# Altium schematic sheet MCU021_V1.0_ezFET_Host.SchDoc: ez-FET: Host-MCU, USB, Power
size A3; Date: Not shown in title block; ApprovedBy: Not shown in title block; CheckedBy: Not shown in title block; Author: Not shown in title block; CompanyName: Not shown in title block; Engineer: Not shown in title block; Organization: Not shown in title block; Address1: Not shown in title block; Address2: Not shown in title block; Address3: Not shown in title block; Address4: Not shown in title block; DocumentNumber: 2; Revision: Use project parameter SCH_Rev; SheetNumber: 2; SheetTotal: 5; PageSetup: Record=PageOptions|CenterHorizontal=True|CenterVertical=True|PrintScale=1.00|XCorrection=1.00|YCorrection=1.00|PrintKind=0|BorderSize=5000000|LeftOffset=0|BottomOffset=0|Orientation=2|PaperLength=1000|PaperWidth=1000|Scale=100|PaperSource=15|PrintQuality=600|MediaType=1|DitherType=10|PaperKind=Letter|PrintScaleMode=1; CurrentTime: Not shown in title block; CurrentDate: Not shown in title block; Time: Not shown in title block; DocumentFullPathAndName: Not shown in title block; DocumentName: Not shown in title block; ModifiedDate: Not shown in title block; ImagePath: Not shown in title block
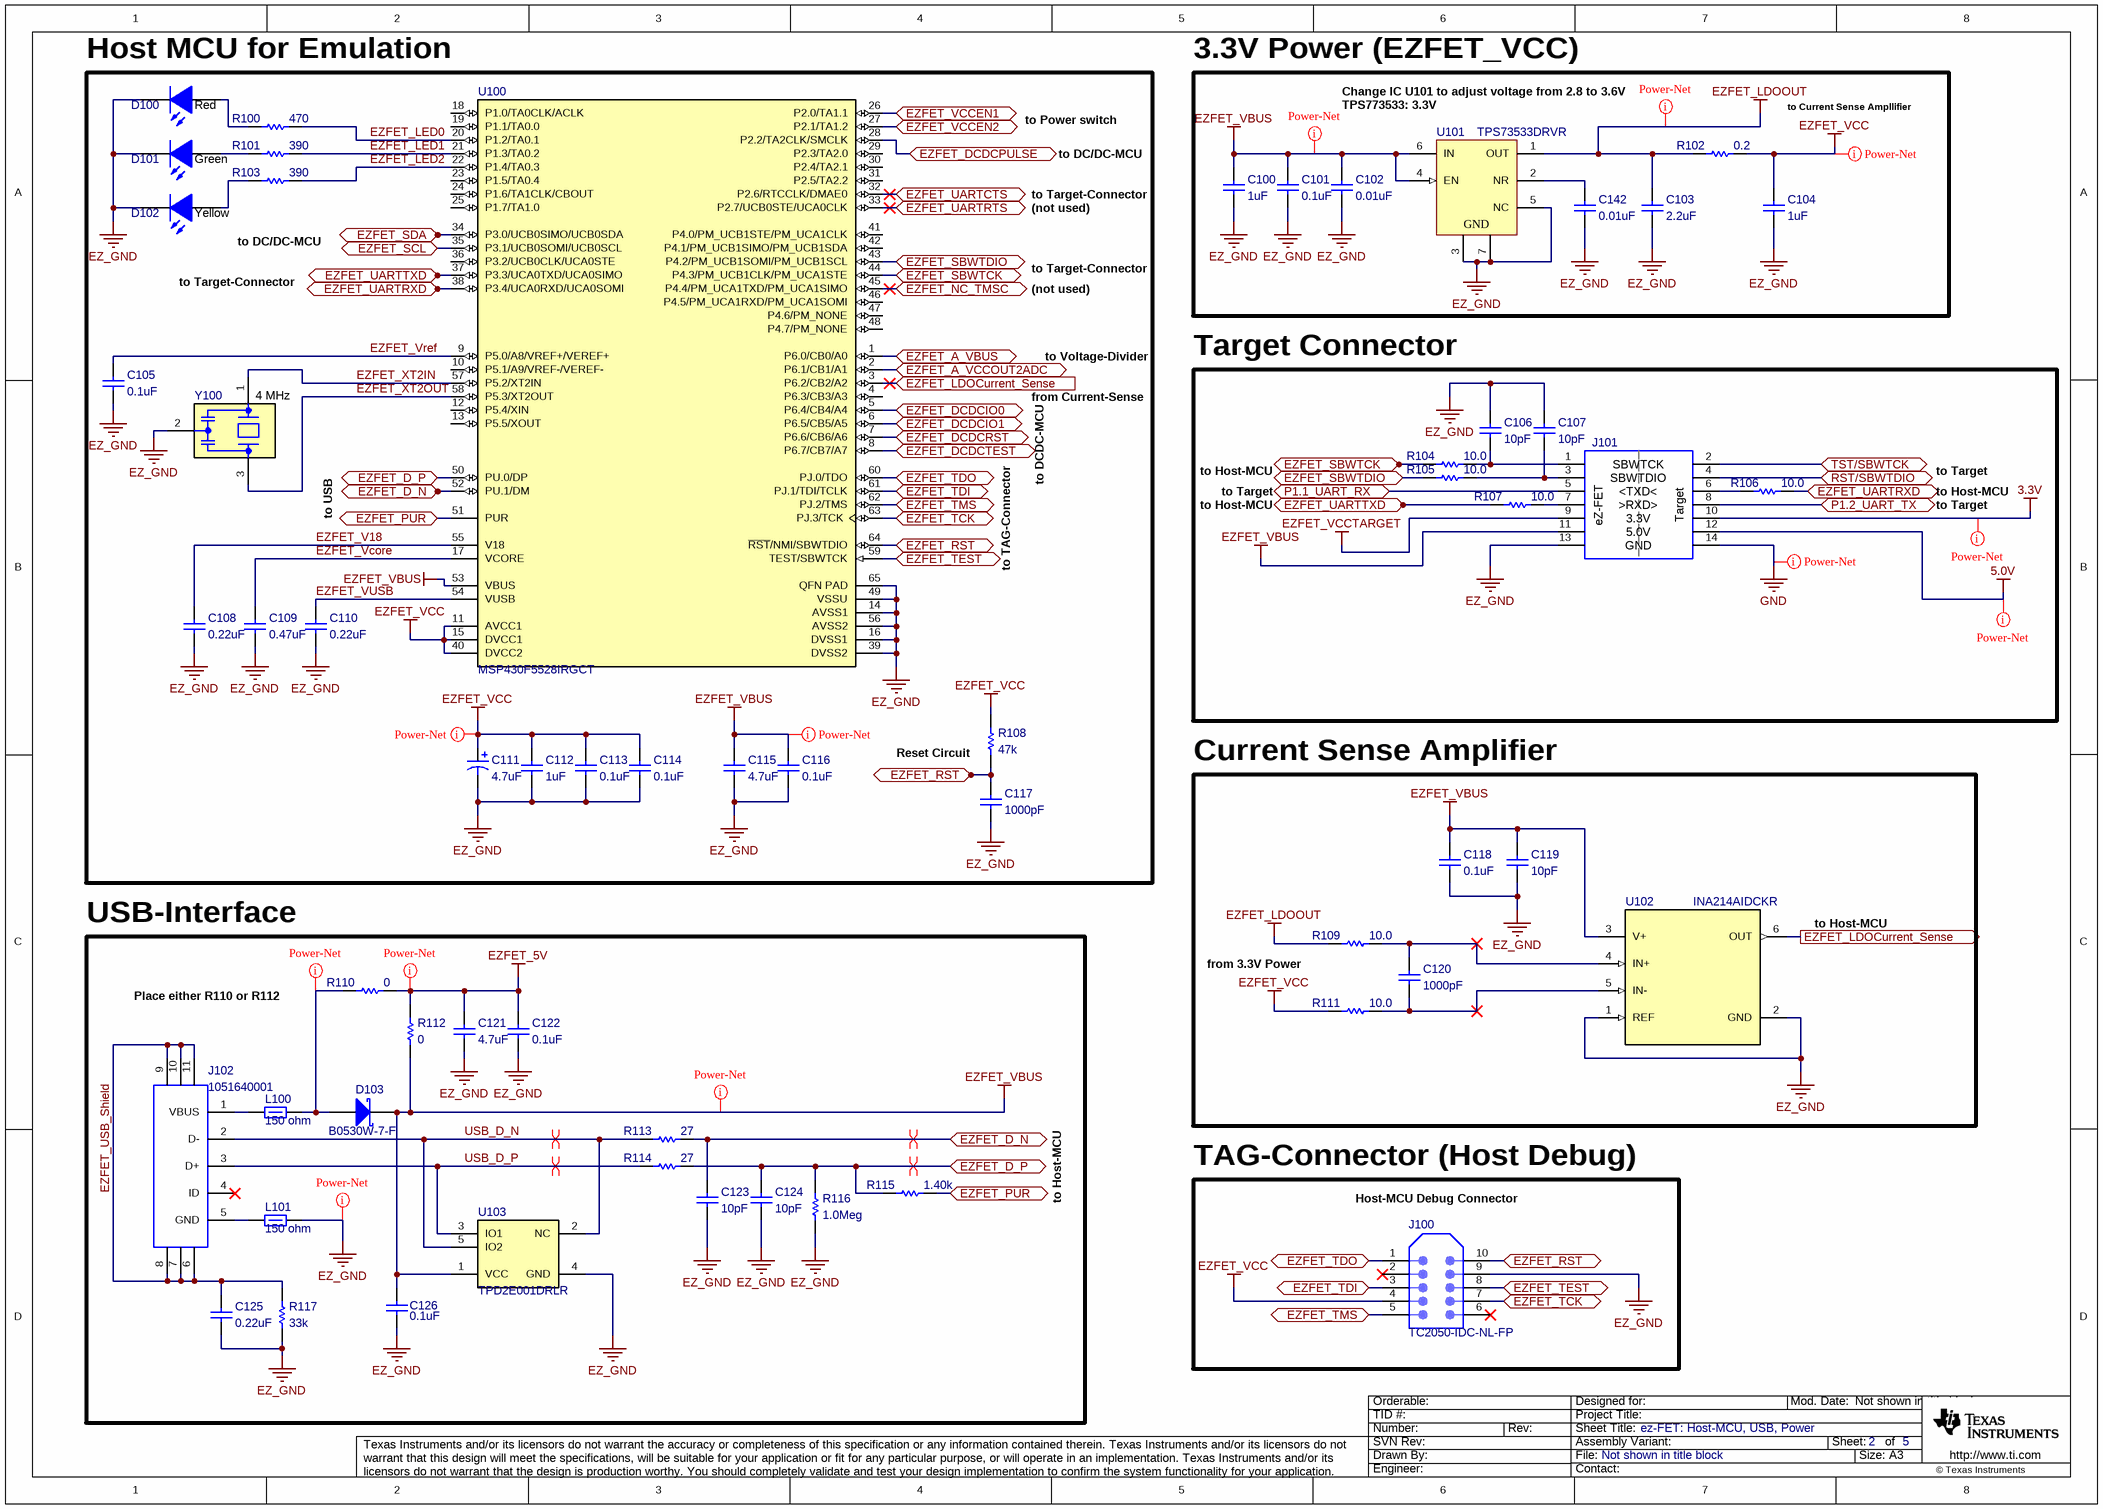
[diagram p0: MCU021_V1.0_ezFET_Host.SchDoc]

## Parts
C100  1uF  [0402]
C101  0.1uF  [0402]
C102  0.01uF  [0402]
C103  2.2uF  [0402]
C104  1uF  [0402]
C105  0.1uF  [0402]
C106  10pF  [0402]
C107  10pF  [0402]
C108  0.22uF  [0402]
C109  0.47uF  [0402]
C110  0.22uF  [0402]
C111  4.7uF  [3216-18]
C112  1uF  [0402]
C113  0.1uF  [0402]
C114  0.1uF  [0402]
C115  4.7uF  [0402]
C116  0.1uF  [0402]
C117  1000pF  [0402]
C118  0.1uF  [0402]
C119  10pF  [0402]
C120  1000pF  [0402]
C121  4.7uF  [0805_HV]
C122  0.1uF  [0402]
C123  10pF  [0402]
C124  10pF  [0402]
C125  0.22uF  [0402]
C126  0.1uF  [0402]
C142  0.01uF  [0402]
D100  value Red  [WL-SMCW_RED]  (hidden comment: 150060RS75000)
D101  value Green  [WL-SMCW_GREEN]  (hidden comment: 150060VS75000)
D102  value Yellow  [WL-SMCW_YELLOW]  (hidden comment: 150060YS75000)
D103  B0530W-7-F  [SOD-123]
J100  TC2050-IDC-NL-FP  [Tag_TC2050-NL]  (no BOM)
J101  PEC07DAAN  [PEC07DAAN_Launchpad_EZ-FET]  (value not drawn)
J102  1051640001  [Molex_1051640001]
L100  150 ohm  [0603]
L101  150 ohm  [0603]
R100  470  [0402]
R101  390  [0402]
R102  0.2  [0603]
R103  390  [0402]
R104  10.0  [0402]
R105  10.0  [0402]
R106  10.0  [0402]
R107  10.0  [0402]
R108  47k  [0402]
R109  10.0  [0402]
R110  0  [1206]
R111  10.0  [0402]
R112  0  [1206]
R113  27  [0402]
R114  27  [0402]
R115  1.40k  [0402]
R116  1.0Meg  [0402]
R117  33k  [0402]
U100  MSP430F5528IRGCT  [RGC0064B]
U101  TPS73533DRVR  [DRV0006A]
U102  INA214AIDCKR  [DCK0006A_N]
U103  TPD2E001DRLR  [DRL0005A]
Y100  Frequency_Fixed: 4 MHz  [Murata_CSTCR]  (hidden comment: CSTCR4M00G15L99-R0)

## Blocks framed on the sheet
Host MCU for Emulation: C105 C108-C117 D100-D102 R100 R101 R103 R108 U100 Y100
3.3V Power (EZFET_VCC): C100-C104 C142 R102 U101
Target Connector: C106 C107 J101 R104-R107
Current Sense Amplifier: C118-C120 R109 R111 U102
USB-Interface: C121-C126 D103 J102 L100 L101 R110 R112-R117 U103
TAG-Connector (Host Debug): J100

## Ports
EZFET_A_VBUS (bidir), EZFET_A_VCCOUT2ADC (bidir), EZFET_D_N (bidir), EZFET_D_P (bidir), EZFET_DCDCIO0 (bidir), EZFET_DCDCIO1 (bidir), EZFET_DCDCPULSE (bidir), EZFET_DCDCRST (bidir), EZFET_DCDCTEST (bidir), EZFET_LDOCurrent_Sense (in), EZFET_LDOCurrent_Sense (out), EZFET_NC_TMSC (bidir), EZFET_PUR (bidir), EZFET_RST (bidir), EZFET_SBWTCK (bidir), EZFET_SBWTDIO (bidir), EZFET_SCL (bidir), EZFET_SDA (bidir), EZFET_TCK (bidir), EZFET_TDI (bidir), EZFET_TDO (bidir), EZFET_TEST (bidir), EZFET_TMS (bidir), EZFET_UARTCTS (bidir), EZFET_UARTRTS (bidir), EZFET_UARTRXD (bidir), EZFET_UARTTXD (bidir), EZFET_VCCEN1 (bidir), EZFET_VCCEN2 (bidir), P1.1_UART_RX (bidir), P1.2_UART_TX (bidir), RST/SBWTDIO (bidir), TST/SBWTCK (bidir)

## Nets
3.3V: J101.10
5.0V: J101.12
EZ_GND: C100.2 C101.2 C102.2 C103.2 C104.2 C105.2 C106.1 C107.1 C108.2 C109.1 C110.2 C111.2(-) C112.2 C113.2 C114.2 C115.2 C116.2 C117.2 C118.2 C119.2 C121.2 C122.2 C123.2 C124.2 C125.2 C126.2 C142.2 D100.1(K) D101.1(K) D102.1(K) J100.9 J101.13 L101.2 R116.1 R117.1 U100.14(AVSS1) U100.16(DVSS1) U100.39(DVSS2) U100.49(VSSU) U100.56(AVSS2) U100.65(QFN_PAD) U101.3(GND) U101.5(NC) U101.7(GND) U102.1(REF) U102.2(GND) U103.4(GND) Y100.2(GND)
EZFET_5V: C121.1 C122.1 R110.1 R112.2
EZFET_LDOOUT: C103.1 R102.1 R109.1 U101.1(OUT)
EZFET_VBUS: C100.1 C101.1 C102.1 C115.1 C116.1 C118.1 C119.1 C126.1 D103.1(K) J101.11 R112.1 U100.53(VBUS) U101.4(EN) U101.6(IN) U102.3(V+) U103.1(VCC)
EZFET_VCC: C104.1 C111.1(+) C112.1 C113.1 C114.1 J100.4 R102.2 R108.2 R111.1 U100.11(AVCC1) U100.15(DVCC1) U100.40(DVCC2)
EZFET_VCCTARGET: J101.9
GND: J101.14
EZFET_A_VBUS: U100.1(P6.0/CB0/A0) ; port EZFET_A_VBUS
EZFET_A_VCCOUT2ADC: U100.2(P6.1/CB1/A1) ; port EZFET_A_VCCOUT2ADC
EZFET_D_N: C123.1 R113.2 U100.52(PU.1/DM) ; port EZFET_D_N
EZFET_D_P: C124.1 R114.2 R115.1 R116.2 U100.50(PU.0/DP) ; port EZFET_D_P
EZFET_DCDCIO0: U100.5(P6.4/CB4/A4) ; port EZFET_DCDCIO0
EZFET_DCDCIO1: U100.6(P6.5/CB5/A5) ; port EZFET_DCDCIO1
EZFET_DCDCPULSE: U100.28(P2.2/TA2CLK/SMCLK) ; port EZFET_DCDCPULSE
EZFET_DCDCRST: U100.7(P6.6/CB6/A6) ; port EZFET_DCDCRST
EZFET_DCDCTEST: U100.8(P6.7/CB7/A7) ; port EZFET_DCDCTEST
EZFET_LDOCurrent_Sense: U100.3(P6.2/CB2/A2) U102.6(OUT) ; port EZFET_LDOCurrent_Sense
EZFET_LED0: R100.2 U100.20(P1.2/TA0.1)
EZFET_LED1: R101.2 U100.21(P1.3/TA0.2)
EZFET_LED2: R103.2 U100.22(P1.4/TA0.3)
EZFET_NC_TMSC: U100.45(P4.4/PM_UCA1TXD/PM_UCA1SIMO) ; port EZFET_NC_TMSC
EZFET_PUR: R115.2 U100.51(PUR) ; port EZFET_PUR
EZFET_RST: C117.1 J100.10 R108.1 U100.64(~{RST}/NMI/SBWTDIO) ; port EZFET_RST
EZFET_SBWTCK: R104.1 U100.44(P4.3/PM_UCB1CLK/PM_UCA1STE) ; port EZFET_SBWTCK
EZFET_SBWTDIO: R105.1 U100.43(P4.2/PM_UCB1SOMI/PM_UCB1SCL) ; port EZFET_SBWTDIO
EZFET_SCL: U100.35(P3.1/UCB0SOMI/UCB0SCL) ; port EZFET_SCL
EZFET_SDA: U100.34(P3.0/UCB0SIMO/UCB0SDA) ; port EZFET_SDA
EZFET_TCK: J100.7 U100.63(PJ.3/TCK) ; port EZFET_TCK
EZFET_TDI: J100.3 U100.61(PJ.1/TDI/TCLK) ; port EZFET_TDI
EZFET_TDO: J100.1 U100.60(PJ.0/TDO) ; port EZFET_TDO
EZFET_TEST: J100.8 U100.59(TEST/SBWTCK) ; port EZFET_TEST
EZFET_TMS: J100.5 U100.62(PJ.2/TMS) ; port EZFET_TMS
EZFET_UARTCTS: U100.32(P2.6/RTCCLK/DMAE0) ; port EZFET_UARTCTS
EZFET_UARTRTS: U100.33(P2.7/UCB0STE/UCA0CLK) ; port EZFET_UARTRTS
EZFET_UARTRXD: R106.2 U100.38(P3.4/UCA0RXD/UCA0SOMI) ; port EZFET_UARTRXD
EZFET_UARTTXD: R107.1 U100.37(P3.3/UCA0TXD/UCA0SIMO) ; port EZFET_UARTTXD
EZFET_USB_Shield: C125.1 J102.6 J102.7 J102.8 J102.9 J102.10 J102.11 R117.2
EZFET_V18: C108.1 U100.55(V18)
EZFET_VCCEN1: U100.26(P2.0/TA1.1) ; port EZFET_VCCEN1
EZFET_VCCEN2: U100.27(P2.1/TA1.2) ; port EZFET_VCCEN2
EZFET_Vcore: C109.2 U100.17(VCORE)
EZFET_Vref: C105.1 U100.9(P5.0/A8/VREF+/VEREF+)
EZFET_VUSB: C110.1 U100.54(VUSB)
EZFET_XT2IN: U100.57(P5.2/XT2IN) Y100.1(In)
EZFET_XT2OUT: U100.58(P5.3/XT2OUT) Y100.3(Out)
P1.1_UART_RX: J101.5 ; port P1.1_UART_RX
P1.2_UART_TX: J101.8 ; port P1.2_UART_TX
RST/SBWTDIO: J101.4 ; port RST/SBWTDIO
TST/SBWTCK: J101.2 ; port TST/SBWTCK
USB_D_N: J102.2(D-) R113.1 U103.2(NC) U103.5(IO2)
USB_D_P: J102.3(D+) R114.1 U103.3(IO1)
NetC106_2: C106.2 J101.1 R104.2
NetC107_2: C107.2 J101.3 R105.2
NetC120_1: C120.1 R109.2 U102.4(IN+)
NetC120_2: C120.2 R111.2 U102.5(IN-)
NetC142_1: C142.1 U101.2(NR)
NetD100_2: D100.2(A) R100.1
NetD101_2: D101.2(A) R101.1
NetD102_2: D102.2(A) R103.1
NetD103_2: D103.2(A) L100.2 R110.2
NetJ101_6: J101.6 R106.1
NetJ101_7: J101.7 R107.2
NetJ102_1: J102.1(VBUS) L100.1
NetJ102_5: J102.5(GND) L101.1

Not connected (* = marked no-connect by the designer): J100 2* 6*; J102 4(ID)*; U100 4(P6.3/CB3/A3) 10(P5.1/A9/VREF-/VEREF-) 12(P5.4/XIN) 13(P5.5/XOUT) 18(P1.0/TA0CLK/ACLK) 19(P1.1/TA0.0) 23(P1.5/TA0.4) 24(P1.6/TA1CLK/CBOUT) 25(P1.7/TA1.0) 29(P2.3/TA2.0) 30(P2.4/TA2.1) 31(P2.5/TA2.2) 36(P3.2/UCB0CLK/UCA0STE) 41(P4.0/PM_UCB1STE/PM_UCA1CLK) 42(P4.1/PM_UCB1SIMO/PM_UCB1SDA) 46(P4.5/PM_UCA1RXD/PM_UCA1SOMI) 47(P4.6/PM_NONE) 48(P4.7/PM_NONE)

## Layout directives
differential pair: EZFET_D_N, EZFET_D_P, USB_D_N, USB_D_P
net class Power-Net: 3.3V, 5.0V, EZ_GND, EZFET_5V, EZFET_LDOOUT, EZFET_VBUS, EZFET_VCC, GND, NetD103_2

## Notes on the sheet
- Change IC U101 to adjust voltage from 2.8 to 3.6V
- (near U101) TPS773533: 3.3V
- to Current Sense Ampllifier
- to Power switch
- to DC/DC-MCU
- to Target-Connector
- (not used)
- to Voltage-Divider
- to DCDC-MCU
- from Current-Sense
- to USB
- to TAG-Connector
- to Host-MCU
- to Target
- (near R108) Reset Circuit
- from 3.3V Power
- Place either R110 or R112
- Host-MCU Debug Connector
- Drawn By:
- SVN Rev:
- Number:
- TID #:
- Orderable:
- Rev:
- Sheet Title:
- File:
- Project Title:
- Designed for:
- Assembly Variant:
- Mod. Date:
- Sheet:
- Size:
- of
- A3
- http://www.ti.com
- Texas Instruments and/or its licensors do not warrant the accuracy or completeness of this specification or any information contained therein. Texas Instruments and/or its licensors do not warrant that this design will meet the specifications, will be suitable for your application or fit for any particular purpose, or will operate in an implementation. Texas Instruments and/or its licensors do not warrant that the design is production worthy. You should completely validate and test your design implementation to confirm the system functionality for your application.
- Engineer:
- Contact:
- © Texas Instruments
- (in symbol PEC07DAAN) SBWTCK; SBWTDIO; <TXD<; eZ-FET; >RXD>; Target; 3.3V; 5.0V; GND

## Library data of the parts
C100 C104 C112 = GRM155R61A105KE15D: CAP, CERM, 1 µF, 10 V,+/- 10%, X5R, 0402; Manufacturer: MuRata; Polarized: N; CompType: Capacitor; ValueDisplayed: 1µF; U/M: EA; Cap_F: 0.000001; Tolerance_%: 10; Value1: Unknown; Value2: 10V; TaMin_C: -55; TaMax_C: 85; SizeArea_mm2: 0.5; SizeAreaWB_mm2: 3; SizeX_mm: 1; SizeZ_mm: 0.6; AEC Category: Q200; Green_Lifecycle: Active; Green_REACh: Passed; SymbolVersion: 2008-07-09; Value: 1uF; PartNumber: GRM155R61A105KE15D; PackageReference: 0402; RoHS: Y; VDC_V: 10; MountType: SMT; Technology: Ceramic; TempCo: X5R; Cap_Case: 0402; SizeY_mm: 0.5; Published: 2008-06-19; Publisher: Texas Instruments; LatestRevisionDate: 2017-05-28; ComponentLink1Description: Datasheet link; ComponentLink1URL: http://search.murata.co.jp/Ceramy/PnsearchViewAction.do?HnOFG=ON&HnNFG=ON&SEL_CNT=50&sLang=en&sKey=GRM155R61A105KE15D&x=9&y=9&search=startwith; Supplier 1: Digi-Key; Supplier Part Number 1: 490-3890-1-ND; Supplier 2: Mouser; Supplier Part Number 2: 81-GRM155R61A105KE15; Supplier 3: Farnell; Supplier Part Number 3: 1735523; AEC Qualified: ?; Green_EU RoHS: Passed; Green_EU RoHS-2: Incomplete
C101 C105 C113 C114 C116 C118 C122 C126 = GRM155R61A104KA01D: CAP, CERM, 0.1 µF, 10 V,+/- 10%, X5R, 0402; Manufacturer: MuRata; Polarized: N; CompType: Capacitor; ValueDisplayed: 0.1µF; U/M: EA; Cap_F: 0.0000001; Tolerance_%: 10; Value1: Unknown; Value2: 10V; TaMin_C: -55; TaMax_C: 85; SizeArea_mm2: 0.5; SizeAreaWB_mm2: 3; SizeX_mm: 1; SizeZ_mm: 0.6; AEC Category: Q200; Green_Lifecycle: Active; Green_REACh: Passed; SymbolVersion: 2008-07-09; Value: 0.1uF; PartNumber: GRM155R61A104KA01D; PackageReference: 0402; RoHS: Y; VDC_V: 10; MountType: SMT; Technology: Ceramic; TempCo: X5R; Cap_Case: 0402; SizeY_mm: 0.5; Published: 2008-06-19; Publisher: Texas Instruments; LatestRevisionDate: 2017-05-28; ComponentLink1Description: Datasheet link; ComponentLink1URL: http://search.murata.co.jp/Ceramy/PnsearchViewAction.do?HnOFG=ON&HnNFG=ON&SEL_CNT=50&sLang=en&sKey=GRM155R61A104KA01D&x=9&y=9&search=startwith; Supplier 1: Digi-Key; Supplier Part Number 1: 490-1318-1-ND; Supplier 2: Mouser; Supplier Part Number 2: 81-GRM155R61A104KA01; Supplier 3: Farnell; Supplier Part Number 3: 1828862; AEC Qualified: ?; Green_EU RoHS: Passed; Green_EU RoHS-2: Incomplete
C102 C142 = GRM155R71C103KA01D: CAP, CERM, 0.01 µF, 16 V,+/- 10%, X7R, 0402; Manufacturer: MuRata; Polarized: N; CompType: Capacitor; ValueDisplayed: 0.01µF; U/M: EA; Cap_F: 0.00000001; Tolerance_%: 10; Value1: Unknown; VDC_V: 16; Value2: 16V; TaMin_C: -55; TaMax_C: 125; SizeArea_mm2: 0.5; SizeAreaWB_mm2: 3; SizeX_mm: 1; SizeZ_mm: 0.6; AEC Category: Q200; Green_Lifecycle: Active; Green_REACh: Passed; SymbolVersion: 2008-07-09; Value: 0.01uF; PartNumber: GRM155R71C103KA01D; PackageReference: 0402; RoHS: Y; MountType: SMT; Technology: Ceramic; TempCo: X7R; Cap_Case: 0402; SizeY_mm: 0.5; Published: 2008-06-19; Publisher: Texas Instruments; LatestRevisionDate: 2017-05-28; ComponentLink1Description: Datasheet link; ComponentLink1URL: http://search.murata.co.jp/Ceramy/PnsearchViewAction.do?HnOFG=ON&HnNFG=ON&SEL_CNT=50&sLang=en&sKey=GRM155R71C103KA01D&x=9&y=9&search=startwith; Supplier 1: Digi-Key; Supplier Part Number 1: 490-1313-1-ND; Supplier 2: Newark; Supplier Part Number 2: 14T3279; Supplier 3: Mouser; Supplier Part Number 3: 81-GRM36X103K16; AEC Qualified: ?; Green_EU RoHS: Passed; Green_EU RoHS-2: Incomplete
C103 = CMP-0006594-2: CAP, CERM, 2.2 uF, 16 V, +/- 10%, X5R, 0402; Manufacturer: MuRata; PartNumber: GRM155R61C225KE11D; TaMin_C: -55°C; Polarized: N; SizeAreaWB_mm2: 3; Value1: Unknown; U/M: EA; TaMax_C: 85°C; SizeZ_mm: 0.6; SizeX_mm: 1; SizeY_mm: 0.5; Value2: 16V; CompType: Capacitor; Cap_F: 2.2µF; AEC Category: Q200; Supplier Part Number 2: 81-GRM155R61C225KE1D; Publisher: Texas Instruments; Supplier 2: Mouser; TempCo: X5R; Published: 2008-06-19; RoHS: Y; MountType: SMT; Value: 2.2uF; Supplier 1: Digi-Key; PackageReference: 0402; Tolerance_%: 10%; Cap_Case: 0402; SizeArea_mm2: 0.5; LatestRevisionDate: 2017-03-09; AEC Qualified: N; VDC_V: 16V; ComponentLink1Description: Datasheet link; AEC Grade: N/A; Supplier Part Number 1: 490-10695-1-ND; Technology: Ceramic; ValueDisplayed: 2.2uF; ComponentLink1URL: http://psearch.en.murata.com/capacitor/product/GRM155R61C225KE11%23.pdf
C106 C107 C119 C123 C124 = GRM1555C1H100FA01D: CAP, CERM, 10 pF, 50 V,+/- 1%, C0G/NP0, 0402; Manufacturer: MuRata; Polarized: N; CompType: Capacitor; U/M: EA; Cap_F: 0.00000000001; Tolerance_%: 1; Value1: Unknown; VDC_V: 50; Value2: 50V; TaMin_C: -55; TaMax_C: 125; SizeArea_mm2: 0.5; SizeAreaWB_mm2: 3; SizeZ_mm: 0.6; AEC Category: Q200; SymbolVersion: 2008-07-09; Value: 10pF; PartNumber: GRM1555C1H100FA01D; ValueDisplayed: 10pF; PackageReference: 0402; RoHS: Y; MountType: SMT; Technology: Ceramic; TempCo: C0G/NP0; Cap_Case: 0402; SizeX_mm: 1; SizeY_mm: 0.5; Published: 2008-06-19; Publisher: Texas Instruments; LatestRevisionDate: 2017-05-28; ComponentLink1Description: Datasheet link; ComponentLink1URL: http://psearch.en.murata.com/capacitor/product/GRM1555C1H100FA01%23.pdf; Supplier 1: Digi-Key; Supplier Part Number 1: 490-6186-1-ND; Supplier 2: Mouser; Supplier Part Number 2: 81-GRM1555C1H100FA1D; AEC Qualified: N; AEC Grade: N/A
C108 C110 C125 = GRM155R61A224KE19D: CAP, CERM, 0.22 µF, 10 V,+/- 10%, X5R, 0402; Manufacturer: MuRata; Polarized: N; CompType: Capacitor; ValueDisplayed: 0.22µF; U/M: EA; Cap_F: 0.00000022; Tolerance_%: 10; Value1: Unknown; Value2: 10V; TaMin_C: -55; TaMax_C: 85; SizeArea_mm2: 0.5; SizeAreaWB_mm2: 3; SizeX_mm: 1; SizeZ_mm: 0.6; AEC Category: Q200; Green_Lifecycle: Active; Green_REACh: Passed; SymbolVersion: 2008-07-09; Value: 0.22uF; PartNumber: GRM155R61A224KE19D; PackageReference: 0402; RoHS: Y; VDC_V: 10; MountType: SMT; Technology: Ceramic; TempCo: X5R; Cap_Case: 0402; SizeY_mm: 0.5; Published: 2008-06-19; Publisher: Texas Instruments; LatestRevisionDate: 2017-05-28; ComponentLink1Description: Datasheet link; ComponentLink1URL: http://search.murata.co.jp/Ceramy/PnsearchViewAction.do?HnOFG=ON&HnNFG=ON&SEL_CNT=50&sLang=en&sKey=GRM155R61A224KE19D&x=9&y=9&search=startwith; Supplier 1: Digi-Key; Supplier Part Number 1: 490-3910-1-ND; Supplier 2: Newark; Supplier Part Number 2: 38K1646; Supplier 3: Mouser; Supplier Part Number 3: 81-GRM155R61A224KE19; AEC Qualified: ?; Green_EU RoHS: Passed; Green_EU RoHS-2: Incomplete
C109 = GRM155R61C474KE01: CAP, CERM, 0.47 µF, 16 V,+/- 10%, X5R, 0402; Manufacturer: MuRata; Polarized: N; CompType: Capacitor; ValueDisplayed: 0.47µF; U/M: EA; Cap_F: 0.00000047; Tolerance_%: 10; Value1: Unknown; VDC_V: 16; Value2: 16V; TaMin_C: -55; TaMax_C: 85; SizeArea_mm2: 0.5; SizeAreaWB_mm2: 3; SizeX_mm: 1; SizeZ_mm: 0.6; AEC Category: Q200; Green_Lifecycle: Active; Green_REACh: Passed; SymbolVersion: 2008-07-09; Value: 0.47uF; PartNumber: GRM155R61C474KE01; PackageReference: 0402; RoHS: Y; MountType: SMT; Technology: Ceramic; TempCo: X5R; Cap_Case: 0402; SizeY_mm: 0.5; Published: 2008-06-19; Publisher: Texas Instruments; LatestRevisionDate: 2017-05-28; ComponentLink1Description: Datasheet link; ComponentLink1URL: http://psearch.murata.com/capacitor/product/GRM155R61C474KE01%23.pdf; AEC Qualified: ?; Green_EU RoHS: Passed; Green_EU RoHS-2: Incomplete
C111 = 293D475X9010A2TE3: CAP, TA, 4.7 µF, 10 V, +/- 10%, 5 ohm, SMD; Manufacturer: Vishay-Sprague; Polarized: Y; CompType: Capacitor; ValueDisplayed: 4.7µF; U/M: EA; Cap_F: 0.0000047; Tolerance_%: 10; Value1: 5 ohm; Value2: 10V; ESR_ohm: 5; IRMS_A: 0.12; TaMin_C: -55; TaMax_C: 125; Cap_Case: A; SizeAreaWB_mm2: 10.92; SizeArea_mm2: 5.12; SizeX_mm: 3.2; SizeY_mm: 1.6; SizeZ_mm: 1.8; AEC Category: Q200; SymbolVersion: 2008-07-09; Value: 4.7uF; PartNumber: 293D475X9010A2TE3; PackageReference: 3216-18; RoHS: Y; VDC_V: 10; MountType: SMT; Technology: TA; Series: 293D; Publisher: Texas Instruments; LatestRevisionDate: 2017-03-13; LatestRevisionNote: Updated supplier links; ComponentLink1Description: Datasheet link; ComponentLink1URL: http://www.vishay.com/docs/40002/293d.pdf; Supplier 1: Digi-Key; Supplier Part Number 1: 718-1146-1-ND; Supplier 2: Mouser; Supplier Part Number 2: 74-293D475X9010A2TE3; Supplier 3: Farnell; Supplier Part Number 3: 197397; AEC Qualified: ?
C115 = GRM155R60J475ME87D: CAP, CERM, 4.7 µF, 6.3 V,+/- 20%, X5R, 0402; Manufacturer: MuRata; Polarized: N; CompType: Capacitor; ValueDisplayed: 4.7µF; U/M: EA; Cap_F: 0.0000047; Tolerance_%: 20; ESR_ohm: 0.009; Value1: 0.009 ohm; VDC_V: 6.3; Value2: 6.3V; IRMS_A: 1.22; TaMin_C: -55; TaMax_C: 85; SizeArea_mm2: 0.5; SizeAreaWB_mm2: 3; SizeX_mm: 1; SizeZ_mm: 0.6; AEC Category: Q200; Green_Lifecycle: Active; Green_REACh: Passed; SymbolVersion: 2008-07-09; Value: 4.7uF; PartNumber: GRM155R60J475ME87D; PackageReference: 0402; RoHS: Y; MountType: SMT; Technology: Ceramic; TempCo: X5R; Cap_Case: 0402; SizeY_mm: 0.5; Published: 2008-06-19; Publisher: Texas Instruments; LatestRevisionDate: 2017-05-28; ComponentLink1Description: Datasheet link; ComponentLink1URL: http://www.murata.com/products/catalog/pdf/c02e.pdf; Supplier 1: Digi-Key; Supplier Part Number 1: 490-5408-1-ND; AEC Qualified: ?; Green_EU RoHS: Passed; Green_EU RoHS-2: Incomplete
C117 C120 = GRM155R71H102KA01D: CAP, CERM, 1000 pF, 50 V,+/- 10%, X7R, 0402; Manufacturer: MuRata; Polarized: N; CompType: Capacitor; U/M: EA; Cap_F: 0.000000001; Tolerance_%: 10; Value1: Unknown; VDC_V: 50; Value2: 50V; TaMin_C: -55; TaMax_C: 125; SizeArea_mm2: 0.5; SizeAreaWB_mm2: 3; SizeX_mm: 1; SizeZ_mm: 0.6; AEC Category: Q200; Green_Lifecycle: Active; Green_REACh: Passed; SymbolVersion: 2008-07-09; Value: 1000pF; PartNumber: GRM155R71H102KA01D; ValueDisplayed: 1000pF; PackageReference: 0402; RoHS: Y; MountType: SMT; Technology: Ceramic; TempCo: X7R; Cap_Case: 0402; SizeY_mm: 0.5; Published: 2008-06-19; Publisher: Texas Instruments; ComponentLink1Description: Datasheet link; ComponentLink1URL: http://search.murata.co.jp/Ceramy/PnsearchViewAction.do?HnOFG=ON&HnNFG=ON&SEL_CNT=50&sLang=en&sKey=GRM155R71H102KA01D&x=9&y=9&search=startwith; Supplier 1: Digi-Key; Supplier Part Number 1: 490-1303-1-ND; Supplier 2: Newark; Supplier Part Number 2: 14T3283; Supplier 3: Mouser; Supplier Part Number 3: 81-GRM36X102K50; AEC Qualified: ?; Green_EU RoHS: Passed; Green_EU RoHS-2: Incomplete
  C117: LatestRevisionDate: 2017-05-28
  C120: LatestRevisionDate: 2017-06-12
C121 = C0805C475K8PACTU: CAP, CERM, 4.7 µF, 10 V,+/- 10%, X5R, 0805; Manufacturer: Kemet; Polarized: N; CompType: Capacitor; ValueDisplayed: 4.7µF; U/M: EA; Cap_F: 0.0000047; Tolerance_%: 10; ESR_ohm: 0.004; Value1: 0.004 ohm; Value2: 10V; IRMS_A: 9.89; TaMin_C: -55; TaMax_C: 85; Cap_Case: 0805; SizeArea_mm2: 2.5; SizeAreaWB_mm2: 6.75; SizeX_mm: 2; SizeY_mm: 1.25; SizeZ_mm: 1.45; AEC Category: Q200; Green_Lifecycle: Active; Green_REACh: Passed; SymbolVersion: 2008-07-09; Value: 4.7uF; PartNumber: C0805C475K8PACTU; PackageReference: 0805; RoHS: Y; VDC_V: 10; MountType: SMT; Technology: Ceramic; TempCo: X5R; Published: 2008-06-19; Publisher: Texas Instruments; LatestRevisionDate: 2017-05-28; ComponentLink1Description: Datasheet link; ComponentLink1URL: http://www.kemet.com/kemet/web/homepage/kechome.nsf/file/Partial%20Copy%20-%20Ceramic%20Surface%20Mount%20Capacitors/$file/F3102_CE.pdf; Supplier 1: Digi-Key; Supplier Part Number 1: 399-3133-1-ND; Supplier 2: Newark; Supplier Part Number 2: 70K9144; Supplier 3: Mouser; Supplier Part Number 3: 80-C0805C475K8P; AEC Qualified: ?; Green_EU RoHS: Passed; Green_EU RoHS-2: Passed
D100 = 150060RS75000: LED, Red, SMD; Manufacturer: Wurth Elektronik; Type: AlInGaP; Vf_V: 2; Value2: 2V; Io_A: 0.03; Vr_V: 5; Tjmax_C: 85; Power_TotalModule: 0.072; Value1: 0.072W; Angle: 140; U/M: EA; Green_Lifecycle: Active; Green_REACh: Passed; CompType: LED; PartNumber: 150060RS75000; SymbolVersion: 2008-11-06; MountType: SMT; RoHS: Y; PackageReference: LED_0603; Color: Red; Published: 2008-07-11; Publisher: Texas Instruments; ComponentLink1URL: http://katalog.we-online.de/led/datasheet/150060RS75000.pdf; ComponentLink1Description: Datasheet link; LatestRevisionDate: 2017-05-19; Supplier 1: Digi-Key; Supplier Part Number 1: 732-4978-1-ND; Supplier 2: Newark; Supplier Part Number 2: 95W3795; Supplier 3: Mouser; Supplier Part Number 3: 710-150060RS75000; Green_EU RoHS: Passed; Green_EU RoHS-2: Incomplete
D101 = 150060VS75000: LED, Green, SMD; Manufacturer: Wurth Elektronik; Type: AlInGaP; Vf_V: 2; Value2: 2V; Io_A: 0.02; Value1: W; U/M: EA; Green_Lifecycle: Active; Green_REACh: Passed; CompType: LED; PartNumber: 150060VS75000; SymbolVersion: 2008-11-06; MountType: SMT; RoHS: Y; PackageReference: LED_0603; Color: green; Published: 2008-07-11; Publisher: Texas Instruments; ComponentLink1URL: http://katalog.we-online.de/led/datasheet/150060VS75000.pdf; ComponentLink1Description: Datasheet link; LatestRevisionDate: 2017-05-19; Supplier 1: Digi-Key; Supplier Part Number 1: 732-4980-1-ND; Supplier 2: Newark; Supplier Part Number 2: 95W3797; Supplier 3: Farnell; Supplier Part Number 3: 2322073; Green_EU RoHS: Passed; Green_EU RoHS-2: Incomplete
D102 = 150060YS75000: LED, Yellow, SMD; Manufacturer: Wurth Elektronik; Type: AlInGaP; Vf_V: 2; Value2: 2V; Io_A: 0.02; Value1: W; U/M: EA; Green_Lifecycle: Active; Green_REACh: Passed; CompType: LED; PartNumber: 150060YS75000; SymbolVersion: 2008-11-06; MountType: SMT; RoHS: Y; PackageReference: LED_0603; Color: yellow; Published: 2008-07-11; Publisher: Texas Instruments; ComponentLink1URL: http://katalog.we-online.de/led/datasheet/150060YS75000.pdf; ComponentLink1Description: Datasheet link; LatestRevisionDate: 2017-05-19; Supplier 1: Digi-Key; Supplier Part Number 1: 732-4981-1-ND; Supplier 2: Newark; Supplier Part Number 2: 95W3798; Supplier 3: Farnell; Supplier Part Number 3: 2322074; Green_EU RoHS: Passed; Green_EU RoHS-2: Incomplete
D103 = B0530W-7-F: Diode, Schottky, 30 V, 0.5 A, SOD-123; Manufacturer: Diodes Inc.; U/M: EA; Vf_V: 0.43; Value: 30V; Value1: 0.5A; Value2: 0.43V; Io_A: 0.5; Vr_V: 30; TJmax_C: 125; SizeAreaWB_mm2: 13.095; SizeArea_mm2: 6.545; SizeX_mm: 3.85; SizeY_mm: 1.7; SizeZ_mm: 1.35; AEC Category: Q101; Green_Lifecycle: Active; Green_REACh: Passed; CompType: Diode; SymbolVersion: 2008-12-08; PartNumber: B0530W-7-F; PackageReference: SOD-123; MountType: SMT; Type: Schottky; RoHS: Y; Published: 2008-06-26; Publisher: Texas Instruments; LatestRevisionDate: 2017-05-30; ComponentLink1Description: Datasheet link; ComponentLink1URL: http://www.diodes.com/datasheets/ds30139.pdf; Supplier 1: Digi-Key; Supplier Part Number 1: B0530W-FDICT-ND; Supplier 2: Newark; Supplier Part Number 2: 12T1451; Supplier 3: Mouser; Supplier Part Number 3: 621-B0530W-F; AEC Qualified: ?; Green_EU RoHS: Passed; Green_EU RoHS-2: Passed
J100 = TC2050-IDC-NL-FP: Footprint for Tag-Connect TC2050 No-Legs cables; SymbolCreator: Altium; CompType: Receptacle; Note: Footprint only, to mate with Tag-Connect TC2050 No-Legs cables; SymbolVersion: 2015-06-15; PartNumber: TC2050-IDC-NL-FP; Manufacturer: Tag-Connect; PackageReference: Footprint for TC2050 No Legs series of cables; MountType: N/A; ComponentLink1Description: Datasheet URL; ComponentLink1URL: http://www.tag-connect.com/Materials/TC2050-IDC-430-NL%20Datasheet.pdf; Publisher: Texas Instruments; LatestRevisionDate: 2017-06-13
J101 = PEC07DAAN: Header, 100mil, 7x2, Tin, TH; Manufacturer: Sullins Connector Solutions; SymbolCreator: a0412235; Pitch_mm: 2.54; Gender: Male; Shrouded: N; Row_Count: 2; Current_A: 3; Voltage_V: 1800; Cert_UL: Y; Green_Lifecycle: Active; Green_REACh: Passed; SymbolVersion: 2017-03-02; PartNumber: PEC07DAAN; PackageReference: Header, 7x2, 100mil, Tin; ClassName: Header; CompType: Header; RoHS: Y; MountType: TH; ComponentLink1Description: Datasheet URL; ComponentLink1URL: http://www.sullinscorp.com/catalogs/77_PAGE108-109_.100_MALE_HDR.pdf; Orientation: Vertical; PinCount: 14; RowSpacing_mm: 2.54; ContactFinish: Tin; Color: Black; Publisher: Texas Instruments; LatestRevisionDate: 2017-05-15; Supplier 1: Digi-Key; Supplier Part Number 1: S2012E-07-ND; Green_EU RoHS: Passed; Green_EU RoHS-2: Passed
J102 = 1051640001: Receptacle, USB 2.0, Micro B, 5 Position, R/A, SMT; Manufacturer: Molex; SymbolCreator: a0411947; Pitch_mm: 0.65; Gender: Female; ContactFinish: Gold; Current_A: 1.8; Voltage_V: 30; Cert_UL: Y; SymbolVersion: 2013-12-17; PartNumber: 1051640001; PackageReference: Receptacle, USB 2.0, Micro B, 5 Pos, 0.65mm Pitch, R/A, SMT; CompType: Receptacle; RoHS: Y; MountType: SMT; ComponentLink1Description: Datasheet URL; ComponentLink1URL: http://www.molex.com/pdm_docs/sd/1051640001_sd.pdf; Orientation: R/A; PinCount: 5; Color: Black; Publisher: Texas Instruments; LatestRevisionDate: 2017-04-13; Supplier 1: Digi-Key; Supplier Part Number 1: WM11263CT-ND; Supplier 2: Newark; Supplier Part Number 2: 99Y3224; Supplier 3: Mouser; Supplier Part Number 3: 538-105164-0001
L100 L101 = BLM18AG151BH1D: Ferrite Bead, 150 ohm @ 100 MHz, 0.7 A, 0603; Manufacturer: MuRata; Imax_A: 0.7; DCR_ohm: 0.35; Value1: 0.35 ohm; Value2: 0.7A; SizeAreaWB_mm2: 4.68; SizeArea_mm2: 1.28; SizeX_mm: 1.6; SizeY_mm: 0.8; SizeZ_mm: 1; ZTyp@100MHz_Ohm: 150; SymbolVersion: 2017-01-06; PartNumber: BLM18AG151BH1D; ValueDisplayed: 150 ohm; CompType: Ferrite Bead; Value: 150 ohm; MountType: SMT; PackageReference: 0603; Published: 2014-04-30; Publisher: Texas Instruments; LatestRevisionDate: 2017-06-15; ComponentLink1Description: Datasheet link; ComponentLink1URL: http://www.murata.com/en-us/products/productdata/8798137286686/QNFA9129.pdf; RoHS: Y; Supplier 1: Digi-Key; Supplier Part Number 1: 490-14035-1-ND; Supplier 2: Mouser; Supplier Part Number 2: 81-BLM18AG151BH1D
R100 = CRCW0402470RJNED: RES, 470, 5%, 0.063 W, 0402; Manufacturer: Vishay-Dale; CompType: Resistor; Value_Code: 470R; Tolerance_%: 5; Power_W: 0.063; Value2: 0.063W; VDC_V: 50; TempCo: 200 ppm/C; SizeArea_mm2: 0.5; SizeX_mm: 1; SizeZ_mm: 0.6; EIA_Code: E24; U/M: EA; AEC Category: Q200; SymbolVersion: 2009-05-29; Value: 470; PartNumber: CRCW0402470RJNED; ValueDisplayed: 470; PackageReference: 0402; RoHS: Y; Res_ohm: 470; Value1: 5%; MountType: SMT; Technology: Thick Film; SizeY_mm: 0.5; Published: 2008-06-26; Publisher: Texas Instruments; LatestRevisionDate: 2017-04-13; ComponentLink1Description: Datasheet link; ComponentLink1URL: http://www.vishay.com/docs/20035/dcrcwe3.pdf; Supplier 1: Digi-Key; Supplier Part Number 1: 541-470JCT-ND; Supplier 2: Newark; Supplier Part Number 2: 59M6737; Supplier 3: Mouser; Supplier Part Number 3: 71-CRCW0402J-470-E3; AEC Qualified: ?
R101 R103 = CRCW0402390RJNED: RES, 390, 5%, 0.063 W, 0402; Manufacturer: Vishay-Dale; CompType: Resistor; Value_Code: 390R; Tolerance_%: 5; Power_W: 0.063; Value2: 0.063W; VDC_V: 50; TempCo: 200 ppm/C; SizeArea_mm2: 0.5; SizeX_mm: 1; SizeZ_mm: 0.6; EIA_Code: E24; U/M: EA; AEC Category: Q200; SymbolVersion: 2009-05-29; Value: 390; PartNumber: CRCW0402390RJNED; ValueDisplayed: 390; PackageReference: 0402; RoHS: Y; Res_ohm: 390; Value1: 5%; MountType: SMT; Technology: Thick Film; SizeY_mm: 0.5; Published: 2008-06-26; Publisher: Texas Instruments; LatestRevisionDate: 2017-04-13; ComponentLink1Description: Datasheet link; ComponentLink1URL: http://www.vishay.com/docs/20035/dcrcwe3.pdf; Supplier 1: Digi-Key; Supplier Part Number 1: 541-390JCT-ND; Supplier 2: Newark; Supplier Part Number 2: 59M6731; Supplier 3: Mouser; Supplier Part Number 3: 71-CRCW0402J-390-E3; AEC Qualified: ?
R102 = CSR0603FKR200: RES, 0.2, 1%, 0.125 W, 0603; Manufacturer: Stackpole Electronics Inc; CompType: Resistor; Value_Code: R200; Tolerance_%: 1; Power_W: 0.125; Value2: 0.125W; VDC_V: 300; TempCo: 25 ppm/C; SizeArea_mm2: 1.28; SizeX_mm: 1.6; SizeY_mm: 0.8; EIA_Code: E96; U/M: EA; AEC Category: Q200; AEC Qualified: N; SymbolVersion: 2009-05-29; Value: 0.2; PartNumber: CSR0603FKR200; ValueDisplayed: 0.2; PackageReference: 0603; RoHS: Y; Res_ohm: 0.2; Value1: 1%; MountType: SMT; Technology: Thick Film; SizeZ_mm: 1; Published: 2008-06-26; Publisher: Texas Instruments; LatestRevisionDate: 2017-06-08; ComponentLink1Description: Datasheet link; ComponentLink1URL: http://www.seielect.com/catalog/SEI-CSR_CSRN.pdf; Supplier 1: Digi-Key; Supplier Part Number 1: CSR0603FKR200CT-ND; AEC Grade: N/A
R104-R107 = CRCW040210R0FKED: RES, 10.0, 1%, 0.063 W, 0402; Manufacturer: Vishay-Dale; CompType: Resistor; Res_ohm: 10; Value_Code: 10R0; Tolerance_%: 1; Power_W: 0.063; Value2: 0.063W; VDC_V: 50; TempCo: 100 ppm/C; SizeArea_mm2: 0.5; SizeZ_mm: 0.6; EIA_Code: E96; U/M: EA; AEC Category: Q200; SymbolVersion: 2009-05-29; Value: 10.0; PartNumber: CRCW040210R0FKED; ValueDisplayed: 10.0; PackageReference: 0402; RoHS: Y; Value1: 1%; MountType: SMT; Technology: Thick Film; SizeX_mm: 1; SizeY_mm: 0.5; Published: 2008-06-26; Publisher: Texas Instruments; LatestRevisionDate: 2017-04-13; ComponentLink1Description: Datasheet link; ComponentLink1URL: http://www.vishay.com/docs/20035/dcrcwe3.pdf; Supplier 1: Digi-Key; Supplier Part Number 1: 541-10.0LCT-ND; Supplier 2: Newark; Supplier Part Number 2: 52K6600; Supplier 3: Mouser; Supplier Part Number 3: 71-CRCW0402-10-E3; AEC Qualified: ?
R108 = CRCW040247K0JNED: RES, 47 k, 5%, 0.063 W, 0402; Manufacturer: Vishay-Dale; CompType: Resistor; Res_ohm: 47000; Value_Code: 47k0; Tolerance_%: 5; Power_W: 0.063; Value2: 0.063W; VDC_V: 50; TempCo: 200 ppm/C; SizeArea_mm2: 0.5; SizeX_mm: 1; SizeZ_mm: 0.6; EIA_Code: E24; U/M: EA; AEC Category: Q200; SymbolVersion: 2009-05-29; Value: 47k; PartNumber: CRCW040247K0JNED; ValueDisplayed: 47k; PackageReference: 0402; RoHS: Y; Value1: 5%; MountType: SMT; Technology: Thick Film; SizeY_mm: 0.5; Published: 2008-06-26; Publisher: Texas Instruments; LatestRevisionDate: 2017-04-13; ComponentLink1Description: Datasheet link; ComponentLink1URL: http://www.vishay.com/docs/20035/dcrcwe3.pdf; Supplier 1: Digi-Key; Supplier Part Number 1: 541-47KJCT-ND; Supplier 2: Newark; Supplier Part Number 2: 52K7099; Supplier 3: Mouser; Supplier Part Number 3: 71-CRCW0402-J-47K-E3; AEC Qualified: ?
R109 R111 = CRCW040210R0FKED: RES, 10.0, 1%, 0.063 W, 0402; Manufacturer: Vishay-Dale; CompType: Resistor; Res_ohm: 10; Value_Code: 10R0; Tolerance_%: 1; Power_W: 0.063; Value2: 0.063W; VDC_V: 50; TempCo: 100 ppm/C; SizeArea_mm2: 0.5; SizeZ_mm: 0.6; EIA_Code: E96; U/M: EA; AEC Category: Q200; Green_Lifecycle: Active; Green_REACh: Passed; SymbolVersion: 2009-05-29; Value: 10.0; PartNumber: CRCW040210R0FKED; ValueDisplayed: 10.0; PackageReference: 0402; RoHS: Y; Value1: 1%; MountType: SMT; Technology: Thick Film; SizeX_mm: 1; SizeY_mm: 0.5; Published: 2008-06-26; Publisher: Texas Instruments; LatestRevisionDate: 2017-06-12; ComponentLink1Description: Datasheet link; ComponentLink1URL: http://www.vishay.com/docs/20035/dcrcwe3.pdf; Supplier 1: Digi-Key; Supplier Part Number 1: 541-10.0LCT-ND; Supplier 2: Newark; Supplier Part Number 2: 52K6600; Supplier 3: Mouser; Supplier Part Number 3: 71-CRCW0402-10-E3; AEC Qualified: ?; Green_EU RoHS: Passed with Exemption; Green_EU RoHS-2: Passed
R110 R112 = CRCW12060000Z0EA: RES, 0, 5%, 0.25 W, 1206; Manufacturer: Vishay-Dale; CompType: Resistor; Value_Code: 0000; Tolerance_%: 5; Power_W: 0.25; Value2: 0.25W; VDC_V: 200; TempCo: 200 ppm/C; SizeArea_mm2: 5.12; SizeX_mm: 3.2; SizeY_mm: 1.6; SizeZ_mm: 1.35; EIA_Code: E24; U/M: EA; AEC Category: Q200; Green_Lifecycle: Active; Green_REACh: Passed; SymbolVersion: 2009-05-29; Value: 0; PartNumber: CRCW12060000Z0EA; ValueDisplayed: 0; PackageReference: 1206; RoHS: Y; Res_ohm: 0; Value1: 5%; MountType: SMT; Technology: Thick Film; Published: 2008-06-26; Publisher: Texas Instruments; LatestRevisionDate: 2017-05-17; ComponentLink1Description: Datasheet link; ComponentLink1URL: http://www.vishay.com/docs/20035/dcrcwe3.pdf; Supplier 1: Digi-Key; Supplier Part Number 1: 541-0.0ECT-ND; Supplier 2: Newark; Supplier Part Number 2: 53K1777; Supplier 3: Mouser; Supplier Part Number 3: 71-CRCW1206-0-E3; AEC Qualified: ?; Green_EU RoHS: Passed with Exemption; Green_EU RoHS-2: Passed
R113 R114 = CRCW040227R0JNED: RES, 27, 5%, 0.063 W, 0402; Manufacturer: Vishay-Dale; CompType: Resistor; Value_Code: 27R0; Tolerance_%: 5; Power_W: 0.063; Value2: 0.063W; VDC_V: 50; TempCo: 200 ppm/C; SizeArea_mm2: 0.5; SizeX_mm: 1; SizeZ_mm: 0.6; EIA_Code: E24; U/M: EA; AEC Category: Q200; SymbolVersion: 2009-05-29; Value: 27; PartNumber: CRCW040227R0JNED; ValueDisplayed: 27; PackageReference: 0402; RoHS: Y; Res_ohm: 27; Value1: 5%; MountType: SMT; Technology: Thick Film; SizeY_mm: 0.5; Published: 2008-06-26; Publisher: Texas Instruments; LatestRevisionDate: 2017-04-13; ComponentLink1Description: Datasheet link; ComponentLink1URL: http://www.vishay.com/docs/20035/dcrcwe3.pdf; Supplier 1: Digi-Key; Supplier Part Number 1: 541-27JCT-ND; Supplier 2: Newark; Supplier Part Number 2: 59M6721; Supplier 3: Mouser; Supplier Part Number 3: 71-CRCW0402J-27-E3; AEC Qualified: ?
R115 = CRCW04021K40FKED: RES, 1.40 k, 1%, 0.063 W, 0402; Manufacturer: Vishay-Dale; CompType: Resistor; Res_ohm: 1400; Value_Code: 1k40; Tolerance_%: 1; Power_W: 0.063; Value2: 0.063W; VDC_V: 50; TempCo: 100 ppm/C; SizeArea_mm2: 0.5; SizeZ_mm: 0.6; EIA_Code: E96; U/M: EA; AEC Category: Q200; SymbolVersion: 2009-05-29; Value: 1.40k; PartNumber: CRCW04021K40FKED; ValueDisplayed: 1.40k; PackageReference: 0402; RoHS: Y; Value1: 1%; MountType: SMT; Technology: Thick Film; SizeX_mm: 1; SizeY_mm: 0.5; Published: 2008-06-26; Publisher: Texas Instruments; LatestRevisionDate: 2017-04-13; ComponentLink1Description: Datasheet link; ComponentLink1URL: http://www.vishay.com/docs/20035/dcrcwe3.pdf; Supplier 1: Digi-Key; Supplier Part Number 1: 541-1.40KLCT-ND; Supplier 2: Newark; Supplier Part Number 2: 52K6569; Supplier 3: Mouser; Supplier Part Number 3: 71-CRCW0402-1.4K-E3; AEC Qualified: ?
R116 = CRCW04021M00JNED: RES, 1.0 M, 5%, 0.063 W, 0402; Manufacturer: Vishay-Dale; CompType: Resistor; ValueDisplayed: 1.0M; Res_ohm: 1000000; Value_Code: 1M00; Tolerance_%: 5; Power_W: 0.063; Value2: 0.063W; VDC_V: 50; TempCo: 200 ppm/C; SizeArea_mm2: 0.5; SizeX_mm: 1; SizeZ_mm: 0.6; EIA_Code: E24; U/M: EA; AEC Category: Q200; SymbolVersion: 2009-05-29; Value: 1.0Meg; PartNumber: CRCW04021M00JNED; PackageReference: 0402; RoHS: Y; Value1: 5%; MountType: SMT; Technology: Thick Film; SizeY_mm: 0.5; Published: 2008-06-26; Publisher: Texas Instruments; LatestRevisionDate: 2017-04-13; ComponentLink1Description: Datasheet link; ComponentLink1URL: http://www.vishay.com/docs/20035/dcrcwe3.pdf; Supplier 1: Digi-Key; Supplier Part Number 1: 541-1.0MJCT-ND; Supplier 2: Newark; Supplier Part Number 2: 59M6694; Supplier 3: Mouser; Supplier Part Number 3: 71-CRCW0402J-1M-E3; AEC Qualified: ?
R117 = CRCW040233K0JNED: RES, 33 k, 5%, 0.063 W, 0402; Manufacturer: Vishay-Dale; CompType: Resistor; Res_ohm: 33000; Value_Code: 33k0; Tolerance_%: 5; Power_W: 0.063; Value2: 0.063W; VDC_V: 50; TempCo: 200 ppm/C; SizeArea_mm2: 0.5; SizeX_mm: 1; SizeZ_mm: 0.6; EIA_Code: E24; U/M: EA; AEC Category: Q200; SymbolVersion: 2009-05-29; Value: 33k; PartNumber: CRCW040233K0JNED; ValueDisplayed: 33k; PackageReference: 0402; RoHS: Y; Value1: 5%; MountType: SMT; Technology: Thick Film; SizeY_mm: 0.5; Published: 2008-06-26; Publisher: Texas Instruments; LatestRevisionDate: 2017-04-13; ComponentLink1Description: Datasheet link; ComponentLink1URL: http://www.vishay.com/docs/20035/dcrcwe3.pdf; Supplier 1: Digi-Key; Supplier Part Number 1: 541-33KJCT-ND; Supplier 2: Newark; Supplier Part Number 2: 59M6727; Supplier 3: Mouser; Supplier Part Number 3: 71-CRCW0402J-33K-E3; AEC Qualified: ?
U100 = MSP430F5528IRGCT: 25 MHz Mixed Signal Microcontroller with 128 KB Flash, 8192 B SRAM and 47 GPIOs, -40 to 85 degC, 64-pin QFN (RGC), Green (RoHS & no Sb/Br); Alternate Manufacturer: Texas Instruments; Alternate PartNumber: Equivalent; ADC: 12-bit SAR; ADC Channels: 16; Brown Out Reset: Yes; DMA: 3; Flash(KB): 128; Frequency(MHz): 25; GPIO: 47; Multiplier: 32x32; Pin/Package: 64DSBGA, 64VQFN, 80BGA MICROSTAR JUNIOR; SRAM(B): 8192; SubFamily: 5 Series; Timers - 16-bit: 4; USB: 1; USCI_A (UART/LIN/IrDA/SPI): 2; DatasheetVersion: SLAS590I; PackageVersion: 4204106/F, 11/2011; PackageReference: RGC0064B; PackageDescription: 64-Pin Plastic Flat Pack, Body 9 x 9 mm, Pitch 0.5 mm; Comparators: Yes; Eco-Plan: Green (RoHS & no Sb/Br); Real-Time Clock: Yes; SVS: Yes; Temp Sensor: Yes; USCI_B (I2C & SPI): 2; Watchdog: Yes; MountType: SMT; ComponentLink1Description: Manufacturer URL; ComponentLink1URL: http://www.ti.com/; ComponentLink2Description: Datasheet; ComponentLink2URL: http://www.ti.com/general/docs/lit/getliterature.tsp?genericPartNumber=MSP430F5528&fileType=pdf; PartNumber: MSP430F5528IRGCT; Manufacturer: Texas Instruments
U101 = CMP-0036330-5: Single Output High PSRR LDO, 500 mA, Fixed 3.3 V Output, 2.7 to 6.5 V Input, with Low IQ, 6-pin SON (DRV), -40 to 125 degC, Green (RoHS & no Sb/Br); Manufacturer: Texas Instruments; SubFamily: Single Channel LDO; Vin(Max)(V): 6.5; Vin(Min)(V): 2.7; Iout(Max)(A): 0.5; Iq(Typ)(mA): 0.04; Fixed Output Options(V): 3.3; Vdo(Typ)(mV): 280; Accuracy(%): 2; CompType: IC; SizeAreaWB_mm2: 9; SizeArea_mm2: 4; SizeZ_mm: 0.8; PackageDescription: WSON-6; Mounting Technology: Surface Mount; ComponentLink3URL: http://www.ti.com/litv/pdf/mpds216d; ComponentLink2Description: Datasheet; PartNumber: TPS73533DRVR; ComponentLink2URL: http://www.ti.com/general/docs/lit/getliterature.tsp?genericPartNumber=TPS73533&fileType=pdf; ComponentLink1URL: http://www.ti.com/; PackageVersion: 4206925/E; ComponentLink3Description: Package Specification; DatasheetVersion: SBVS087J; ComponentLink1Description: Manufacturer URL; PackageReference: DRV0006A; Eco-Plan: Green (RoHS & no Sb/Br); Vout Adj(Max)(V): 3.3; Vout Adj(Min)(V): 3.3; MountType: SMT; SizeX_mm: 2; SizeY_mm: 2
U102 = INA214AIDCKR: Voltage Output, High or Low Side Measurement, Bi-Directional Zerø-Drift Series Current-Shunt Monitor, DCK0006A (SOT-SC70-6); Alternate PartNumber: INA214AIDCKT; Manufacturer: Texas Instruments; SymbolCreator: a0411947; SizeArea_mm2: 4.2; SizeAreaWB_mm2: 9.3; SizeX_mm: 2.1; SizeY_mm: 2; SizeZ_mm: 1.1; CompType: IC; U/M: EA; SymbolVersion: 2013-07-03; PartNumber: INA214AIDCKR; PackageReference: DCK0006A; PackageDescription: SOT-SC70-6; MountType: SMT; ComponentLink1Description: Datasheet Link; ComponentLink1URL: http://www.ti.com/lit/ds/symlink/ina214.pdf; RoHS: Y; Publisher: Texas Instruments; LatestRevisionDate: 2017-05-22; Alternate Manufacturer: Texas Instruments
U103 = TPD2E001DRLR: Low-Capacitance + / - 15 kV ESD-Protection Array for High-Speed Data Interfaces, 2 Channels, -40 to +85 degC, 5-pin SOT (DRL), Green (RoHS & no Sb/Br); Manufacturer: Texas Instruments; Alternate PartNumber: Equivalent; Breakdown Voltage(Min)(V): 11; IEC 61000-4-2 Air-Gap(+/- kV): 15; IEC 61000-4-2 Contact(+/- kV): 8; IO Capacitance(Typ)(pF): 1.5; IO Leakage Current(nA): 1; SubFamily: ESD Solution; USB High Speed: TRUE; DatasheetVersion: SLLS684F; PackageVersion: revD, Aug-2007; PackageReference: DRL0005A; PackageDescription: 5-Pin Plastic Small Outline, Flat Lead 0.5 mm Pitch; Supplier 1: Digi-Key; Supplier Part Number 1: 296-21883-2-ND; Supplier 2: Digi-Key; Supplier Part Number 2: 296-21883-1-ND; Supplier 3: Digi-Key; Supplier Part Number 3: 296-21883-6-ND; Supplier 4: Farnell; Supplier Part Number 4: 1412055; Supplier 5: Newark; Supplier Part Number 5: 41M5840; Supplier 6: Mouser; Supplier Part Number 6: 595-TPD2E001DRLR; Eco-Plan: Green (RoHS & no Sb/Br); MountType: SMT; PartNumber: TPD2E001DRLR; ComponentLink1Description: Datasheet; ComponentLink1URL: http://www.ti.com/general/docs/lit/getliterature.tsp?genericPartNumber=TPD2E001&fileType=pdf; ComponentLink2Description: URL Link1; ComponentLink2URL: SamplesURL:http://www.ti.com/product/tpd2e001#samples; Alternate Manufacturer: Texas Instruments
Y100 = CSTCR4M00G15L99-R0: Resonator, 4 MHz, 39pF SMD; Manufacturer: MuRata; SymbolCreator: a0799721; U/M: EA; TaMin_C: 0; TaMax_C: 70; Frequency Stability: ±0.08 %; Green_Lifecycle: Not Set; Green_REACh: Incomplete; SymbolVersion: 2016-2-15; PartNumber: CSTCR4M00G15L99-R0; CompType: Resonator; PackageReference: 4.5x1.2x2 mm; MountType: SMT; RoHS: Y; ComponentLink1Description: Datasheet Link; ComponentLink1URL: http://www.murata.com/products/catalog/pdf/p16e.pdf; Publisher: Texas Instruments; LatestRevisionDate: 2017-05-30; Supplier 1: Digi-Key; Supplier Part Number 1: 490-7861-1-ND; Supplier 2: Newark; Supplier Part Number 2: 45Y4897; Supplier 3: Mouser; Supplier Part Number 3: 81-CSTCR4M00G15L99R0; Green_EU RoHS: Incomplete; Green_EU RoHS-2: Incomplete